# EAGLE design MEGA-JTAG (EAGLE 6.5.0)
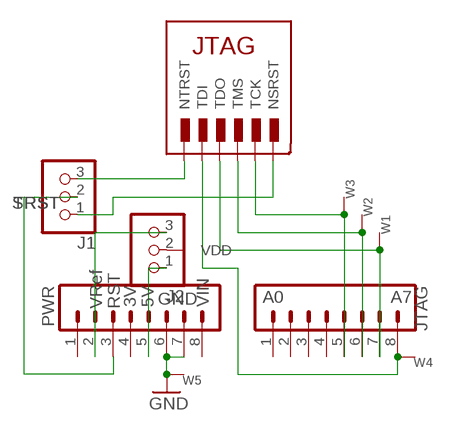
[diagram p0: schematic, sheet 1]

## Parts
J1  JUMPER_1X3ALT  [JUMPER_SOLDER]
J2  JUMPER_1X3ALT  [JUMPER_SOLDER]
JP1  JTAG  M08LOCK_LONGPADS  [1X08_LOCK_LONGPADS]
JP2  PWR  M08LOCK_LONGPADS  [1X08_LOCK_LONGPADS]
U$1  JTAG6/10  [JTAG10]
W1  WIRE-VIA8  [VIA8]
W2  WIRE-VIA8  [VIA8]
W3  WIRE-VIA8  [VIA8]
W4  WIRE-VIA8  [VIA8]
W5  WIRE-VIA8  [VIA8]

## Nets
GND: JP2.6 JP2.7 W5.P$1
N$1: J1.3 U$1.8.NTRST(NTRST)
N$2: J1.1 U$1.6.NSRST(NSRST)
N$3: J2.2 U$1.4.VTREF(VDD)
N$4: J2.1 JP2.5
N$5: J2.3 JP2.2
NSRST: J1.2 JP2.3
TCK: JP1.5 U$1.1.TCK(TCK) W3.P$1
TDI: JP1.8 U$1.9.TDI(TDI) W4.P$1
TDO: JP1.7 U$1.3.TDO(TDO) W1.P$1
TMS: JP1.6 U$1.5.TMS(TMS) W2.P$1
Unconnected: JP1.1 JP1.2 JP1.3 JP1.4 JP2.1 JP2.4 JP2.8

## Notes on the sheet
- 3V | 5V | GND | VIN | A0 | A7
- VRef | RST

## Power pins joined to a net without a drawn wire
GND: U$1.2.GND(GND) U$1.10.GND(GND)

## Library data of the parts
J1 = dp_devices:JUMPER_1X3; J12: SRST; J23: TRST
J2 = dp_devices:JUMPER_1X3
JP1 JP2 = SparkFun-Connectors:M08: Header 8 Standard 8-pin 0.1" header. Use with straight break away headers (SKU : PRT-00116), right angle break away headers (PRT-00553), swiss pins (PRT-00743), machine pins (PRT-00117), and female headers (PRT-00115).
U$1 = mylib4:JTAG6/10: JTAG connector (10 pin)
W1-W5 = mylib4:WIRE: Pad for a wire offboard

## Net classes
0 default: width 0.4 mm
1 power: width 1 mm

## Board
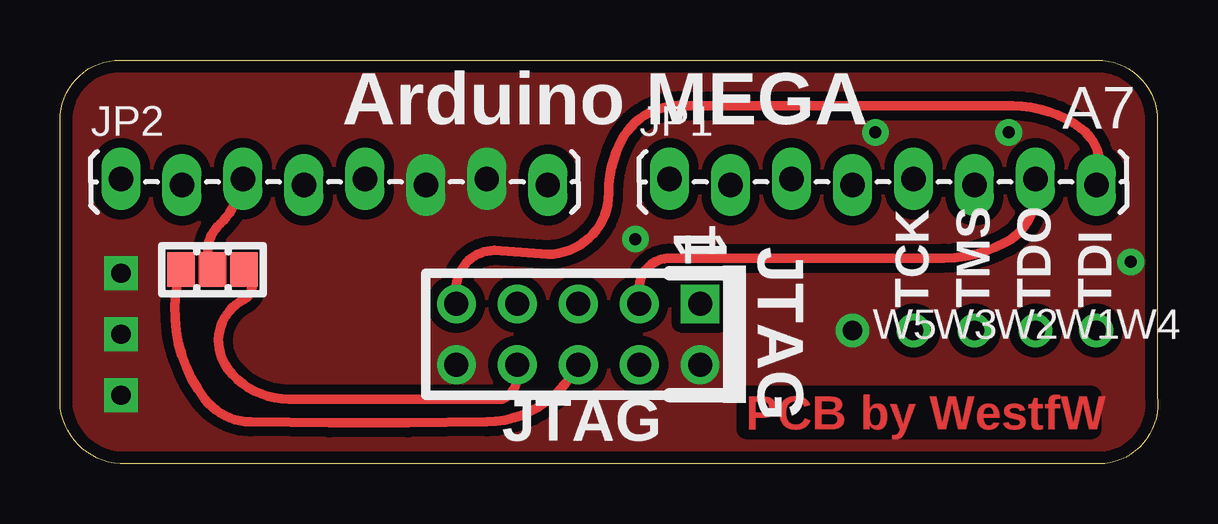
[diagram p1: board, top side]
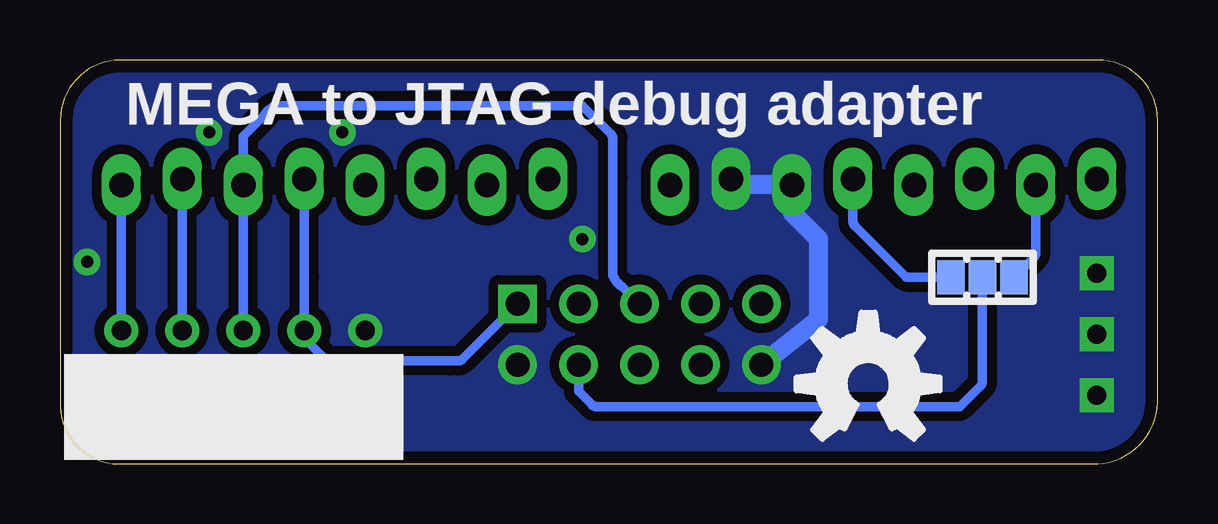
[diagram p2: board, bottom side, seen from below]

Size 45.74 x 16.83 mm. Coordinates in mm from the lower left corner, seen from the top.
Outline: 0,4.76 0,14.33 arc-90 2.5,16.83 41.28,16.83 43.22,16.83 arc-90 45.72,14.33 45.72,7.3 45.72,2.82 arc-90 43.54,0 24.45,0 2.5,0 arc-90 0,2.82 0,4.76
Copper layers (1*16): Top 0.035mm / dielectric 1.5mm / Bottom 0.035mm
Design rules "default *": minimum track width 10mil, minimum drill 24mil, track to track 8mil, track to pad 8mil, pad to pad 8mil, via to via 8mil, smd to smd 8mil, copper to edge 20mil, drill to drill 8mil, minimum pad ring 12mil, minimum via ring 12mil, stop-mask expansion 4mil, vias tented up to drill 0.6mm, thermal gap 10mil

### Footprints (pad centres in the part's own frame; a part is rotated, then mirrored left to right if it is on the bottom)
JUMPER_SOLDER = smd 1.143 x 1.422: 1 -1.308,0; 2 0,0; 3 1.308,0
1X08_LOCK_LONGPADS = drill 1.016 long: 1 0,0.127; 2 2.54,-0.127; 3 5.08,0.127; 4 7.62,-0.127; 5 10.16,0.127; 6 12.7,-0.127; 7 15.24,0.127; 8 17.78,-0.127
JTAG10 = drill 1 square: 1.TCK -1.27,3.81 | drill 1: 2.GND 1.27,3.81; 3.TDO -1.27,1.27; 4.VTREF 1.27,1.27; 5.TMS -1.27,-1.27; 6.NSRST 1.27,-1.27; 7.NC -1.27,-3.81; 8.NTRST 1.27,-3.81; 9.TDI -1.27,-6.35; 10.GND 1.27,-6.35
VIA8 = drill 0.8: P$1 0,0

### Placement (x,y rotation side)
J1  6.35,8.1 0 top
J2  7.31,7.78 0 bottom
JP1  25.4,11.75 0 top
JP2  2.54,11.75 0 top
U$1  22.86,5.4 270 top
W1  40.64,5.56 0 top
W2  38.1,5.56 0 top
W3  35.56,5.56 0 top
W4  43.18,5.56 0 top
W5  33.02,5.56 0 top

### Tracks (layer width: path | path; a pad name or v marks a point on that pad's centre or on a via)
GND  (via drill 0.5, 0.8)
  Bottom 0.8: JP2.7 17.78,11.75 17.78,11.62 JP2.6 15.24,10.48 14.13,9.37 14.13,6.03 U$1.10.GND
  other vias: 2.54,7.94 2.54,5.4 2.54,2.86 23.97,9.37 39.53,13.81 33.98,13.81 44.61,8.41
  pour Top (isolate 0.4, no thermals): -1.27,18.1 47.63,18.1 47.63,-0.32 -1.27,-0.32
  pour Bottom (isolate 0.4, no thermals): -1.9,18.73 47.63,18.73 47.63,-1.59 -1.9,-1.59
N$1
  Top 0.4: U$1.8.NTRST 19.05,3.65 arc-67 18.42,2.7 9.53,2.7 arc-53 6.99,3.97 arc-99 7.62,6.83 arc120 J1.3
N$2
  Top 0.4: U$1.6.NSRST 21.28,3.65 arc-55 17.78,1.75 arc-2 7.94,1.75 arc-51 6.04,2.7 arc-55 J1.1
N$3
  Bottom 0.4: J2.2 7.31,3.44 arc45 7.38,3.26 8.26,2.38 23.39,2.38 arc45 23.57,2.46 24.13,3.02 U$1.4.VTREF
N$4
  Bottom 0.4: JP2.5 12.7,10.11 arc-45 12.63,9.93 10.48,7.78 J2.1
N$5
  Bottom 0.4: JP2.2 5.08,8.8 arc45 5.16,8.62 J2.3
NSRST
  Top 0.4: JP2.3 7.31,10.95 arc-29 6.67,10 arc78 J1.2
TCK
  Bottom 0.4: JP1.5 35.56,7.78 W3.P$1 35.56,5.24 34.68,4.36 arc-45 34.51,4.29 29.53,4.29 29.16,4.29 arc-45 28.98,4.36 U$1.1.TCK
TDI
  Top 0.4: U$1.9.TDI 16.51,7.3 arc-90 18.1,8.89 20.32,8.73 arc90 22.86,11.27 arc-32 23.5,13.65 arc-63 26.04,14.92 39.69,14.92 arc-37 42.55,13.97 arc-76 JP1.8
  Bottom 0.4: JP1.8 W4.P$1
TDO
  Top 0.4: U$1.3.TDO 24.13,7.3 arc-90 25.4,8.57 36.83,8.57 arc28 39.37,9.21 arc73 JP1.7
  Bottom 0.4: W1.P$1 JP1.7
TMS
  Bottom 0.4: U$1.5.TMS 22.31,7.39 arc45 22.7,7.88 22.7,11.91 22.7,13.55 arc-45 22.78,13.73 23.97,14.92 36.73,14.92 arc-45 37.22,14.53 38.1,13.65 JP1.6 W2.P$1

### Text on the board
Top: PCB by WestfW
tPlace: Arduino MEGA | A7 | 1 | JTAG | TCK | TMS | TDO | TDI
bPlace: MEGA to JTAG debug adapter